# EAGLE design TeensyTAF_4 Board_2_Small (EAGLE 9.6.2)
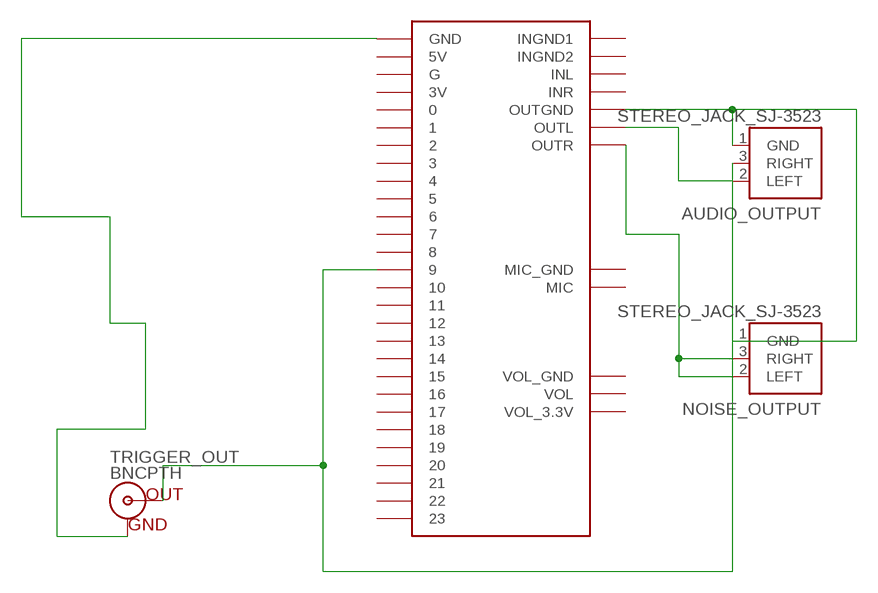
[diagram p0: schematic, sheet 1]

## Parts
AUDIO_OUTPUT  STEREO_JACK_SJ-3523  [SJ-3523]
NOISE_OUTPUT  STEREO_JACK_SJ-3523  [SJ-3523]
TRIGGER_OUT  BNCPTH  [BNC]
U$3  AUDIOSHIELD  [AUDIOSHIELD]

## Nets
N$4: AUDIO_OUTPUT.3(RIGHT) TRIGGER_OUT.S(OUT) U$3.9
N$5: AUDIO_OUTPUT.2(LEFT) U$3.OUTL
N$6: NOISE_OUTPUT.2(LEFT) NOISE_OUTPUT.3(RIGHT) U$3.OUTR
N$7: AUDIO_OUTPUT.1(GND) NOISE_OUTPUT.1(GND) U$3.OUTGND
N$8: TRIGGER_OUT.GND U$3.GND
Unconnected: U$3.0 U$3.1 U$3.2 U$3.3 U$3.3V U$3.4 U$3.5 U$3.5V U$3.6 U$3.7 U$3.8 U$3.10 U$3.11 U$3.12 U$3.13 U$3.14 U$3.15 U$3.16 U$3.17 U$3.18 U$3.19 U$3.20 U$3.21 U$3.22 U$3.23 U$3.G U$3.GND_MIC(MIC_GND) U$3.INGND1 U$3.INGND2 U$3.INL U$3.INR U$3.MIC U$3.VOL U$3.VOL_3.3V U$3.VOL_GND

## Library data of the parts
AUDIO_OUTPUT NOISE_OUTPUT = RHD2000_eval_board:STEREO_JACK: CUI Inc. SJ-3523 stereo audio jack
TRIGGER_OUT = SparkFun-Connectors:BNC: BNC Right Angle Connector Mouser Part# 5227161 SparkFun Products: BNC Connector - Right Angle <https://www.sparkfun.com/products/10550>; PROD_ID: LPA-12729; SF_ID: PRT-10550
U$3 = Teensy_Audioshield:AUDIOSHIELD: Teensy 3 Audioshield by PJRC.COM

## Board
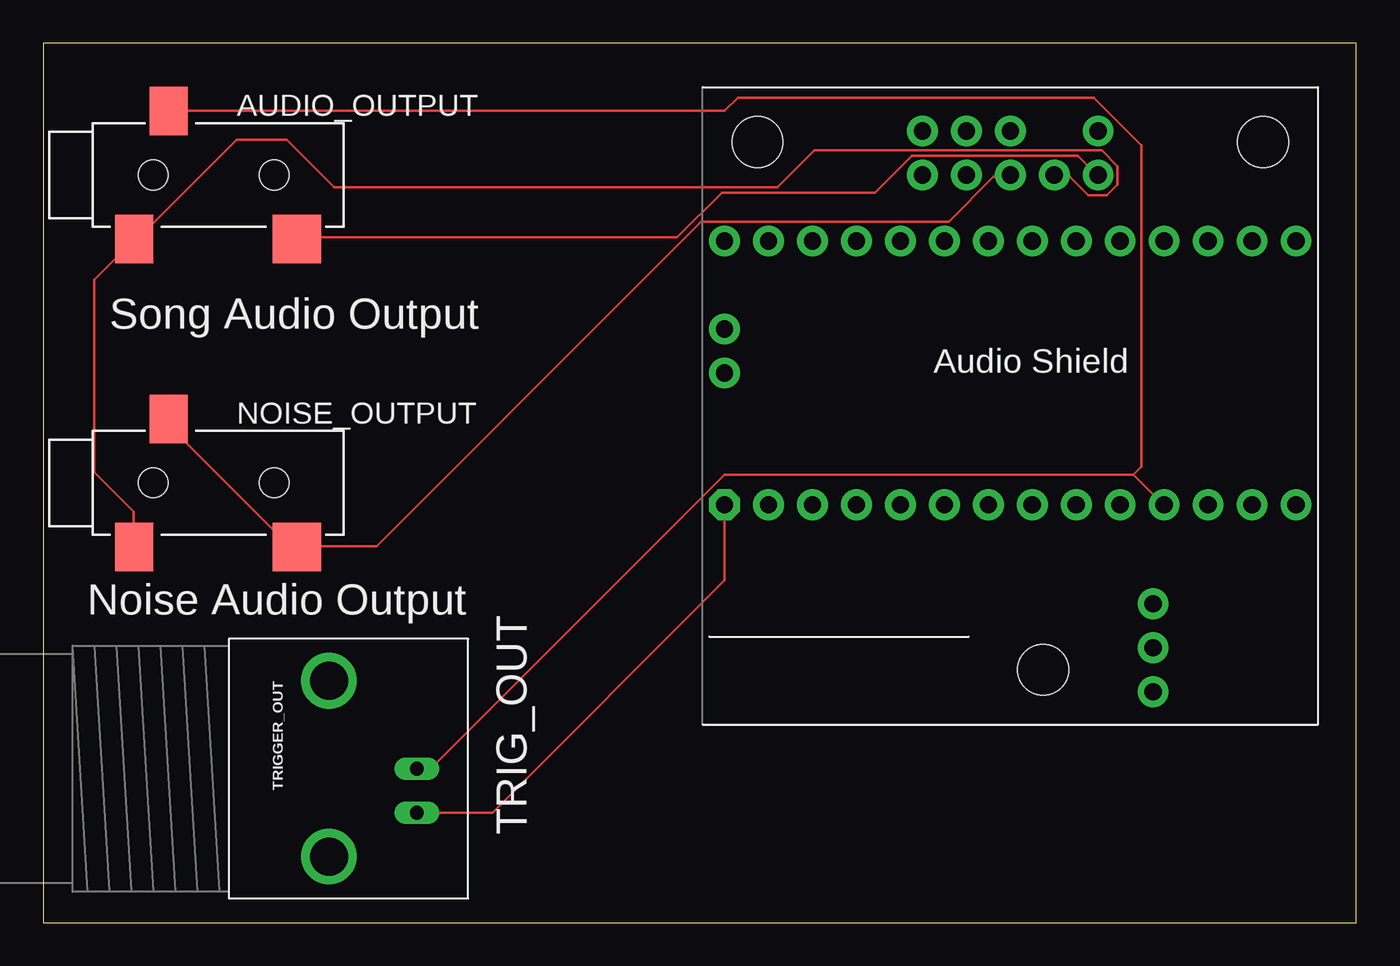
[diagram p1: board, top side]

Size 75.87 x 50.79 mm. Coordinates in mm from the lower left corner, seen from the top.
Outline: 0,0 75.87,0 75.87,50.79 0,50.79 0,0
Copper layers (1*16): Top 0.035mm / dielectric 1.5mm / Bottom 0.035mm
Design rules "default": minimum track width 6mil, minimum drill 0.35mm, track to track 6mil, track to pad 6mil, pad to pad 6mil, via to via 6mil, smd to smd 6mil, copper to edge 40mil, drill to drill 6mil, minimum pad ring 10mil, minimum via ring 8mil, stop-mask expansion 4mil, vias tented up to drill 0mil, thermal gap 10mil

### Footprints (pad centres in the part's own frame; a part is rotated, then mirrored left to right if it is on the bottom)
SJ-3523 = smd 2.2 x 2.8: 1 -1.1,-3.7; 3 0.9,3.7 | smd 2.8 x 2.8: 2 8.3,-3.7 | hole 1.7: 7,0; 0,0
BNC = drill 2.2: 3 -5.08,5.08; 4 5.08,5.08 | drill 0.8 long: GND -2.54,0; S 0,0
AUDIOSHIELD = drill 1 pad 1.778: 0 -13.97,-5.08; 1 -11.43,-5.08; 2 -8.89,-5.08; 3 -6.35,-5.08; 3V -11.43,10.16; 4 -3.81,-5.08; 5 -1.27,-5.08; 5V -16.51,10.16; 6 1.27,-5.08; 7 3.81,-5.08; 8 6.35,-5.08; 9 8.89,-5.08; 10 11.43,-5.08; 11 13.97,-5.08; 12 16.51,-5.08; 13 16.51,10.16; 14 13.97,10.16; 15 11.43,10.16; 16 8.89,10.16; 17 6.35,10.16; 18 3.81,10.16; 19 1.27,10.16; 20 -1.27,10.16; 21 -3.81,10.16; 22 -6.35,10.16; 23 -8.89,10.16; G -13.97,10.16; GND_MIC -16.51,2.54; INGND1 -5.08,16.51; INGND2 -2.54,16.51; INL -5.08,13.97; INR -2.54,13.97; MIC -16.51,5.08; OUTGND 2.54,13.97; OUTL 5.08,13.97; OUTR 0,13.97; UNUSED1 0,16.51; UNUSED2 5.08,16.51; VOL 8.255,-13.335; VOL_3.3V 8.255,-15.875; VOL_GND 8.255,-10.795 | drill 1 pad 1.778 octagon: GND -16.51,-5.08 | hole 2.921: 1.905,-14.605; -14.605,15.875; 14.605,15.875

### Placement (x,y rotation side)
AUDIO_OUTPUT  6.35,43.18 0 top
NOISE_OUTPUT  6.35,25.4 0 top
TRIGGER_OUT  21.59,8.89 90 top
U$3  55.88,29.21 0 top

### Tracks (layer width: path | path; a pad name or v marks a point on that pad's centre or on a via)
N$4
  Top 0.152: 62.99,25.86 39.37,25.86 22.45,8.94 21.69,8.94 TRIGGER_OUT.S | 62.99,25.86 64.67,24.18 U$3.9 | 62.99,25.86 63.45,26.31 63.45,44.91 60.71,47.65 40.13,47.65 39.37,46.89 7.37,46.89 AUDIO_OUTPUT.3
N$5
  Top 0.152: AUDIO_OUTPUT.2 14.68,39.57 36.63,39.57 39.22,42.16 48.06,42.16 50.19,44.3 59.79,44.3 60.86,43.23 U$3.OUTL
N$6
  Top 0.152: NOISE_OUTPUT.3 7.37,29.06 7.37,28.6 14.22,21.74 14.53,21.74 NOISE_OUTPUT.2 14.68,21.74 19.25,21.74 38,40.49 52.32,40.49 54.92,43.08 55.83,43.08 U$3.OUTR
N$7
  Top 0.152: NOISE_OUTPUT.1 5.23,21.74 5.23,23.72 2.95,26.01 2.95,37.13 5.23,39.42 AUDIO_OUTPUT.1 5.38,39.42 11.18,45.21 14.07,45.21 16.82,42.47 42.42,42.47 44.55,44.6 61.16,44.6 62.08,43.69 62.08,42.62 61.47,42.01 60.4,42.01 59.33,43.08 58.42,43.08 U$3.OUTGND
N$8
  Top 0.152: U$3.GND 39.37,19.76 25.96,6.35 TRIGGER_OUT.GND

### Text on the board
tNames: Song Audio Output | Noise Audio Output | TRIG_OUT | BNC 3 | BNC 2 | BNC 1